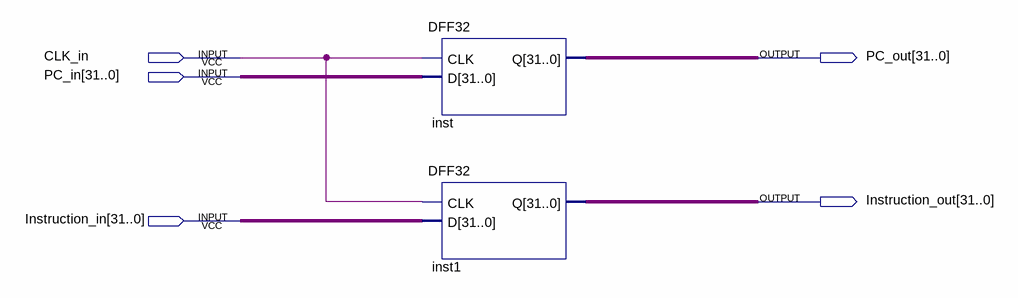
[diagram p0: schematic sheet]
// Quartus schematic IF_ID.bdf as structural Verilog: 2 symbols, 5 pins
module IF_ID (
  input  CLK_in,
  input  [31:0] PC_in,
  input  [31:0] Instruction_in,
  output [31:0] PC_out,
  output [31:0] Instruction_out
);

  DFF32 inst (.CLK(CLK_in), .D(PC_in), .Q(PC_out));
  DFF32 inst1 (.CLK(CLK_in), .D(Instruction_in), .Q(Instruction_out));
endmodule
